# Altium project MAGI'sMegaCore.PrjPcb
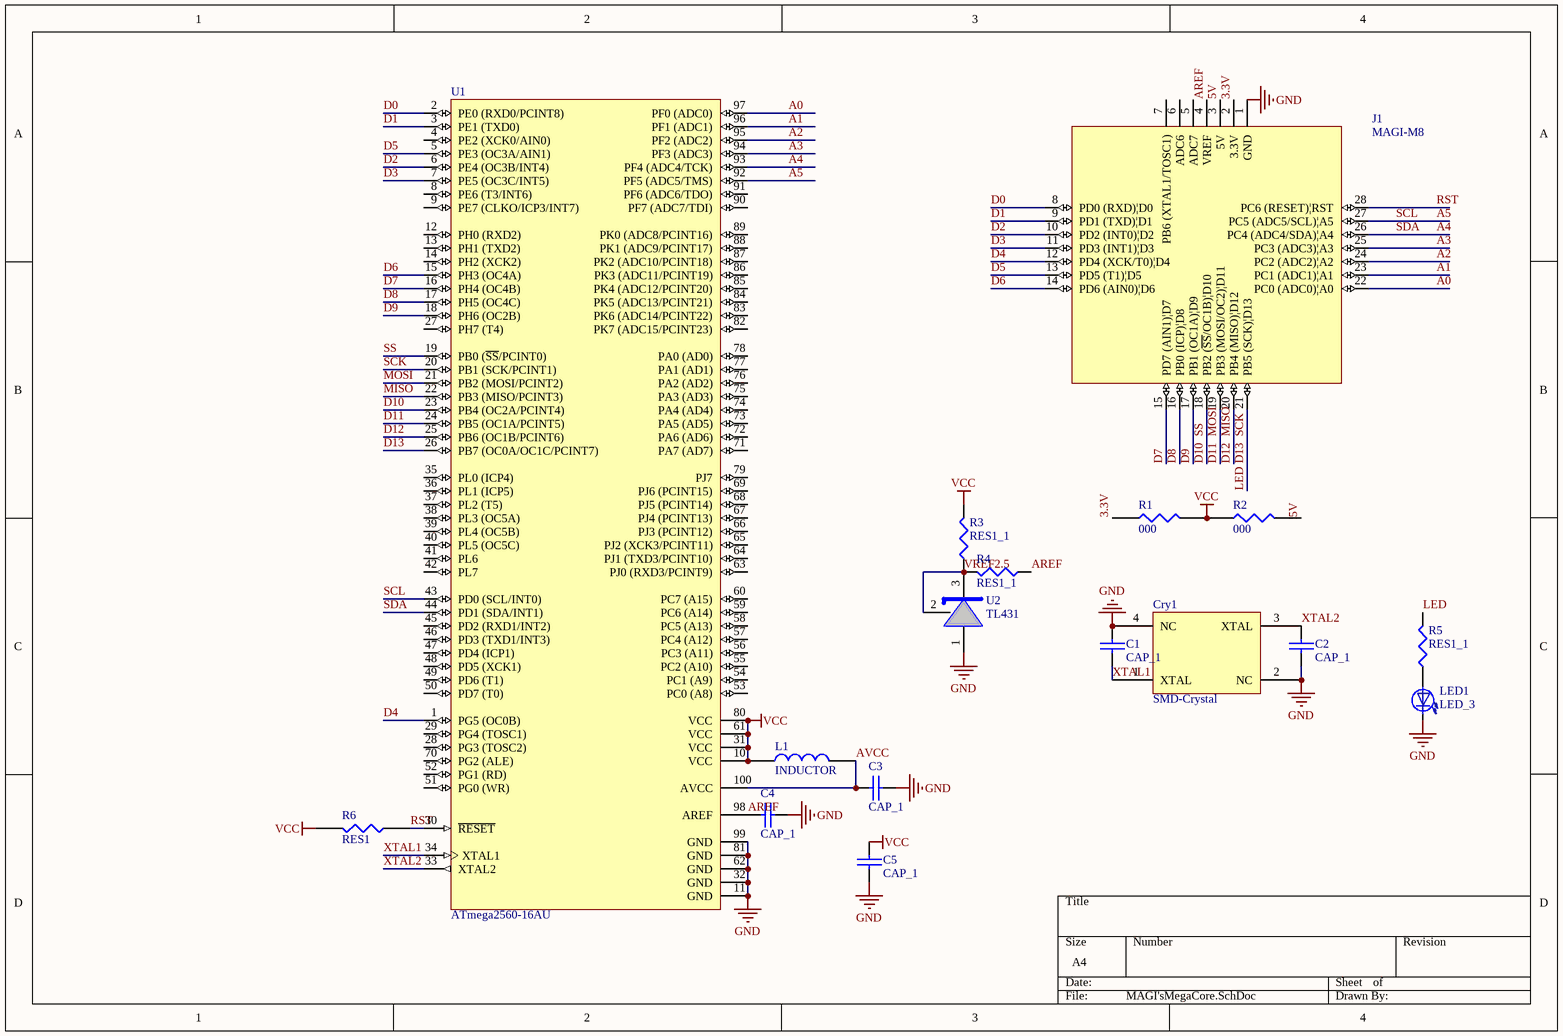
[diagram p0: MAGI'sMegaCore.SchDoc]
1 sheet, 17 parts. Net scope: global (net labels, ports and power ports of the same name join across sheets).
Board file: MAGI'sMegaCore.PcbDoc

## Sheet MAGI'sMegaCore.SchDoc
size A4

### Parts
C1  CAP_1  [1608[0603]]
C2  CAP_1  [1608[0603]]
C3  CAP_1  [6-0805_N]
C4  CAP_1  [6-0805_N]
C5  CAP_1  [C1210_N]
Cry1  SMD-Crystal  [3225]
J1  MAGI-M8  [MAGI-M8]
L1  INDUCTOR  [6-0805_n]
LED1  LED_3  [6-0805_N]
R1  000  [6-0805_N]
R2  000  [6-0805_N]
R3  RES1_1  [6-0805_N]
R4  RES1_1  [6-0805_N]
R5  RES1_1  [6-0805_N]
R6  RES1  [6-0805_N]
U1  ATmega2560-16AU  [100A_N]
U2  TL431  [SOT23_N]

### Nets
GND: C1.2 C2.1 C3.1 C4.1 C5.1 Cry1.2(NC) Cry1.4(NC) J1.1(GND) LED1.2(K) U1.11(GND) U1.32(GND) U1.62(GND) U1.81(GND) U1.99(GND) U2.1(CATHODE)
VCC: C5.2 L1.2 R1.2 R2.1 R3.2 R6.2 U1.10(VCC) U1.31(VCC) U1.61(VCC) U1.80(VCC)
3.3V: J1.2(3.3V) R1.1
5V: J1.3(5V) R2.2
A0: J1.22(PC0_(ADC0)|A0) U1.97(PF0_(ADC0))
A1: J1.23(PC1_(ADC1)|A1) U1.96(PF1_(ADC1))
A2: J1.24(PC2_(ADC2)|A2) U1.95(PF2_(ADC2))
A3: J1.25(PC3_(ADC3)|A3) U1.94(PF3_(ADC3))
A4: J1.26(PC4_(ADC4/SDA)|A4) U1.44(PD1_(SDA/INT1)) U1.93(PF4_(ADC4/TCK))  [also labelled SDA]
A5: J1.27(PC5_(ADC5/SCL)|A5) U1.43(PD0_(SCL/INT0)) U1.92(PF5_(ADC5/TMS))  [also labelled SCL]
AREF: C4.2 J1.4(VREF) R4.1 U1.98(AREF)
AVCC: C3.2 L1.1 U1.100(AVCC)
D0: J1.8(PD0_(RXD)|D0) U1.2(PE0_(RXD0/PCINT8))
D1: J1.9(PD1_(TXD)|D1) U1.3(PE1_(TXD0))
D2: J1.10(PD2_(INT0)|D2) U1.6(PE4_(OC3B/INT4))
D3: J1.11(PD3_(INT1)|D3) U1.7(PE5_(OC3C/INT5))
D4: J1.12(PD4_(XCK/T0)|D4) U1.1(PG5_(OC0B))
D5: J1.13(PD5_(T1)|D5) U1.5(PE3_(OC3A/AIN1))
D6: J1.14(PD6_(AIN0)|D6) U1.15(PH3_(OC4A))
D7: J1.15(PD7_(AIN1)|D7) U1.16(PH4_(OC4B))
D8: J1.16(PB0_(ICP)|D8) U1.17(PH5_(OC4C))
D9: J1.17(PB1_(OC1A)|D9) U1.18(PH6_(OC2B))
D10: J1.18(PB2_(~{SS}/OC1B)|D10) U1.19(PB0_(~{SS}/PCINT0)) U1.23(PB4_(OC2A/PCINT4))  [also labelled SS]
D11: J1.19(PB3_(MOSI/OC2)|D11) U1.21(PB2_(MOSI/PCINT2)) U1.24(PB5_(OC1A/PCINT5))  [also labelled MOSI]
D12: J1.20(PB4_(MISO)|D12) U1.22(PB3_(MISO/PCINT3)) U1.25(PB6_(OC1B/PCINT6))  [also labelled MISO]
D13: J1.21(PB5_(SCK)|D13) R5.2 U1.20(PB1_(SCK/PCINT1)) U1.26(PB7_(OC0A/OC1C/PCINT7))  [also labelled LED, SCK]
RST: J1.28(PC6_(RESET)|RST) R6.1 U1.30(~{RESET})
VREF2.5: R3.1 R4.2 U2.2(REF) U2.3(ANODE)
XTAL1: C1.1 Cry1.1(XTAL) U1.34(XTAL1)
XTAL2: C2.2 Cry1.3(XTAL) U1.33(XTAL2)
NetLED1_1: LED1.1(A) R5.1

Not connected (* = marked no-connect by the designer): J1 5(ADC7) 6(ADC6) 7(PB6_(XTAL1/TOSC1)); U1 4(PE2_(XCK0/AIN0)) 8(PE6_(T3/INT6)) 9(PE7_(CLKO/ICP3/INT7)) 12(PH0_(RXD2)) 13(PH1_(TXD2)) 14(PH2_(XCK2)) 27(PH7_(T4)) 28(PG3_(TOSC2)) 29(PG4_(TOSC1)) 35(PL0_(ICP4)) 36(PL1_(ICP5)) 37(PL2_(T5)) 38(PL3_(OC5A)) 39(PL4_(OC5B)) 40(PL5_(OC5C)) 41(PL6) 42(PL7) 45(PD2_(RXD1/INT2)) 46(PD3_(TXD1/INT3)) 47(PD4_(ICP1)) 48(PD5_(XCK1)) 49(PD6_(T1)) 50(PD7_(T0)) 51(PG0_(WR)) 52(PG1_(RD)) 53(PC0_(A8)) 54(PC1_(A9)) 55(PC2_(A10)) 56(PC3_(A11)) 57(PC4_(A12)) 58(PC5_(A13)) 59(PC6_(A14)) 60(PC7_(A15)) 63(PJ0_(RXD3/PCINT9)) 64(PJ1_(TXD3/PCINT10)) 65(PJ2_(XCK3/PCINT11)) 66(PJ3_(PCINT12)) 67(PJ4_(PCINT13)) 68(PJ5_(PCINT14)) 69(PJ6_(PCINT15)) 70(PG2_(ALE)) 71(PA7_(AD7)) 72(PA6_(AD6)) 73(PA5_(AD5)) 74(PA4_(AD4)) 75(PA3_(AD3)) 76(PA2_(AD2)) 77(PA1_(AD1)) 78(PA0_(AD0)) 79(PJ7) 82(PK7_(ADC15/PCINT23)) 83(PK6_(ADC14/PCINT22)) 84(PK5_(ADC13/PCINT21)) 85(PK4_(ADC12/PCINT20)) 86(PK3_(ADC11/PCINT19)) 87(PK2_(ADC10/PCINT18)) 88(PK1_(ADC9/PCINT17)) 89(PK0_(ADC8/PCINT16)) 90(PF7_(ADC7/TDI)) 91(PF6_(ADC6/TDO))

### Library data of the parts
C1-C5 = CAP_1: Capacitor
Cry1 = Crystal
R1 R2 = RES1
U1 = ATmega2560-16AU: 8-bit AVR Microcontroller, 4.5-5.5V, 256KB Flash, 4KB EEPROM, 8KB SRAM, 86 GPIO pins, 100-pin TQFP, Industrial Grade (-40癈 to 85癈), Pb-Free; Published: 1-Apr-2010; DatasheetVersion: revL, Aug-2007; PackageVersion: revC, Oct-2001; PackageReference: 100A; Publisher: Altium Limited; PackageDescription: 100-Pin Thin Profile Plastic Quad Flat Pack (TQFP), 14 x 14 x 1.0 mm Body, 0.5 mm Pitch; Supplier 1: Digi-Key; Supplier Part Number 1: ATMEGA2560-16AU-ND; Supplier 2: Farnell; Supplier Part Number 2: 1288330; Supplier 3: Farnell; Supplier Part Number 3: 1661740; Supplier 4: Mouser; Supplier Part Number 4: 556-ATMEGA2560-16AU; Code_JEDEC: MS-026-AED; ComponentLink1Description: Manufacturer Link; ComponentLink1URL: http://www.atmel.com/products/avr/default.asp?; ComponentLink2Description: ATmega640/1280/1281/2560/2561 Datasheet; ComponentLink2URL: http://www.atmel.com/dyn/resources/prod_documents/doc2549.pdf; ComponentLink3Description: ATmega640/1280/1281/2560/2561 Summary; ComponentLink3URL: http://www.atmel.com/dyn/resources/prod_documents/2549S.pdf; ComponentLink4Description: Atmel.com Home; ComponentLink4URL: http://www.atmel.com